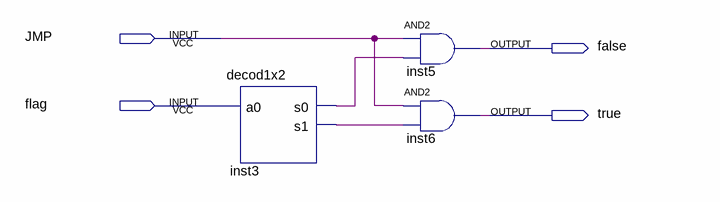
[diagram p0: schematic sheet]
// Quartus schematic cond_test.bdf as structural Verilog: 3 symbols, 4 pins
module cond_test (
  input  JMP,
  input  flag,
  output false,
  output true
);

  wire inst3_s0, inst3_s1;

  decod1x2 inst3 (.a0(flag), .s0(inst3_s0), .s1(inst3_s1));
  and inst5 (false, JMP, inst3_s0);
  and inst6 (true, JMP, inst3_s1);
endmodule
